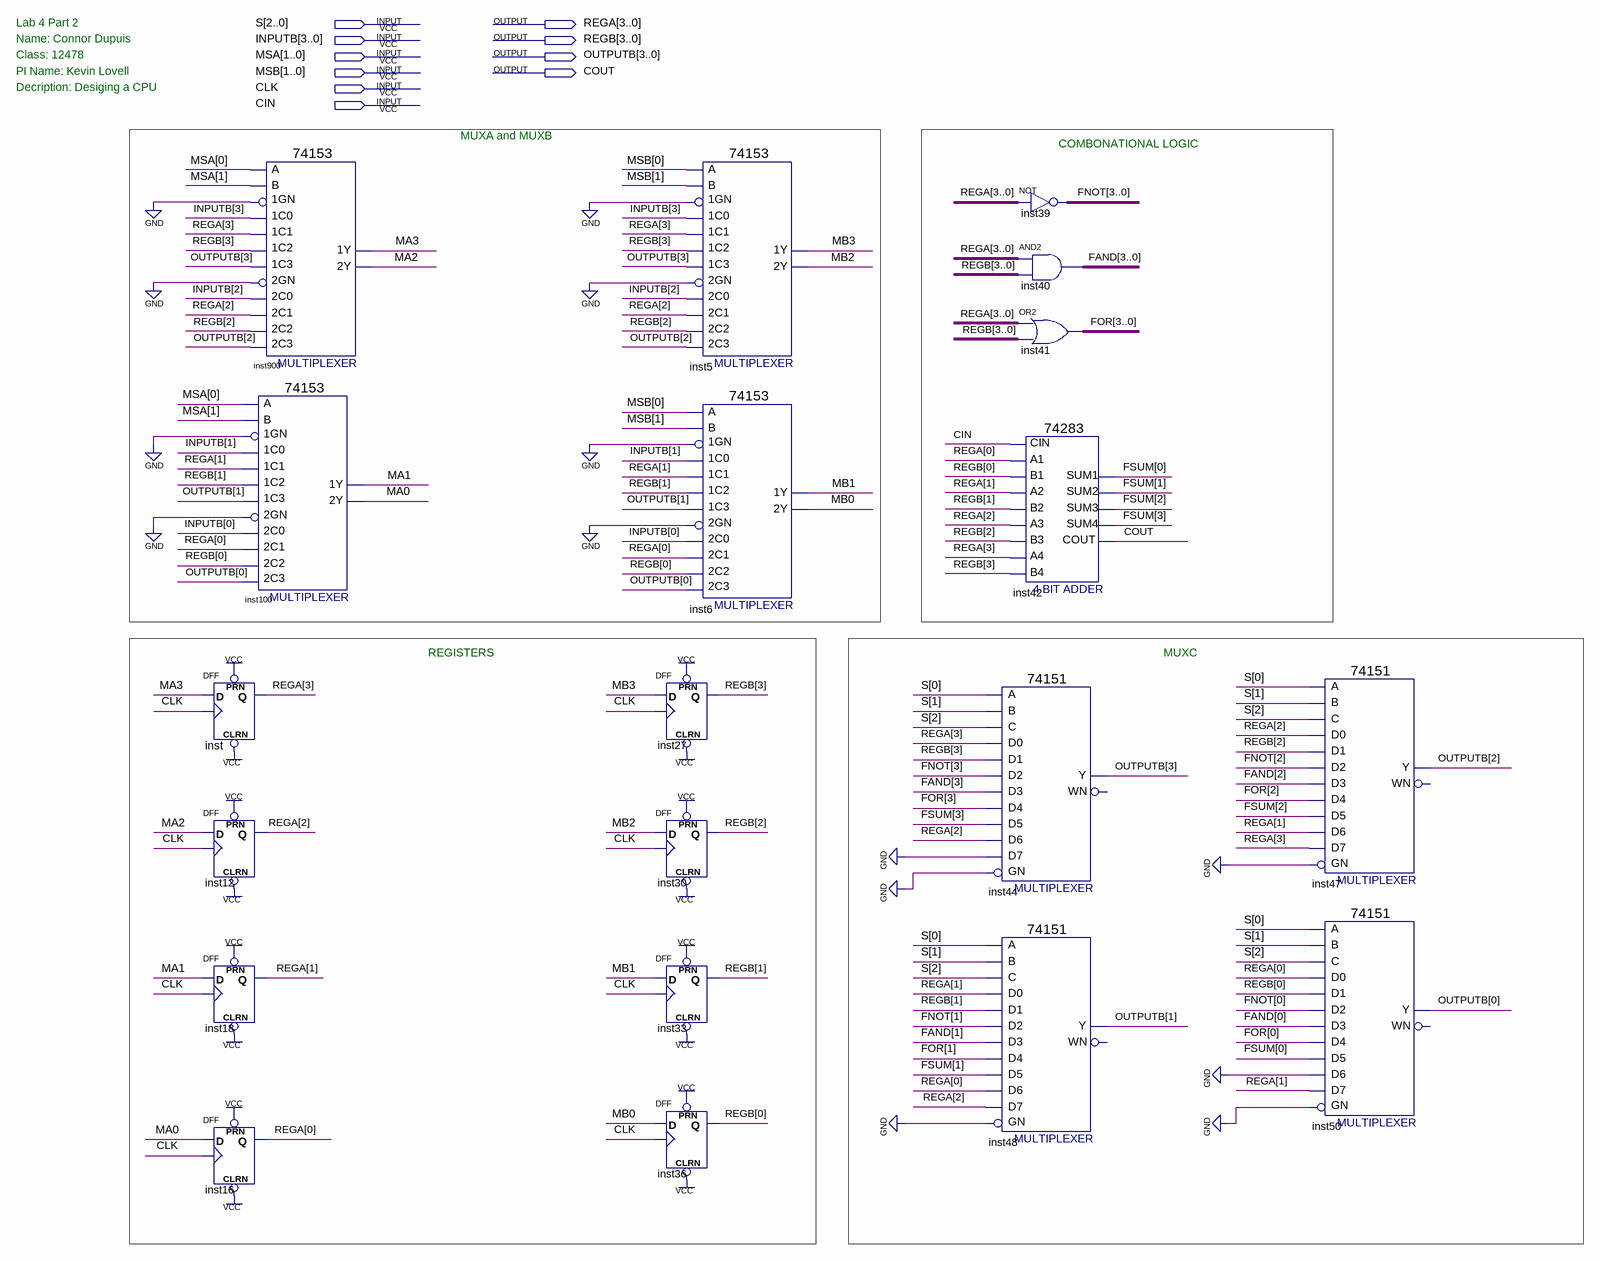
[diagram p0: schematic sheet]
// Quartus schematic Lab4_CPU.bdf as structural Verilog: 20 symbols, 10 pins
module Lab4_CPU (
  input  [2:0] S,
  input  [3:0] INPUTB,
  input  [1:0] MSA,
  input  [1:0] MSB,
  input  CLK,
  input  CIN,
  output [3:0] REGA,
  output [3:0] REGB,
  output [3:0] OUTPUTB,
  output COUT
);

  wire MA0, MA1, MA2, MA3, MB0, MB1, MB2, MB3;
  wire [3:0] FAND, FNOT, FOR, FSUM;

  DFF inst (.CLRN(1'b1), .CLK(CLK), .D(MA3), .PRN(1'b1), .Q(REGA[3]));
  DFF inst12 (.CLRN(1'b1), .CLK(CLK), .D(MA2), .PRN(1'b1), .Q(REGA[2]));
  DFF inst18 (.CLRN(1'b1), .CLK(CLK), .D(MA1), .PRN(1'b1), .Q(REGA[1]));
  DFF inst16 (.CLRN(1'b1), .CLK(CLK), .D(MA0), .PRN(1'b1), .Q(REGA[0]));
  \74153  inst900 (
    .\1C1 (REGA[3]), .\1GN (1'b0), .\1C0 (INPUTB[3]), .\2C0 (INPUTB[2]), .\2GN (1'b0), .\2C2 (REGB[2]),
    .\1C2 (REGB[3]), .\1C3 (OUTPUTB[3]), .B(MSA[1]), .A(MSA[0]), .\2C1 (REGA[2]), .\2C3 (OUTPUTB[2]),
    .\1Y (MA3), .\2Y (MA2));
  \74153  inst100 (
    .\1C1 (REGA[1]), .\1GN (1'b0), .\1C0 (INPUTB[1]), .\2C0 (INPUTB[0]), .\2GN (1'b0), .\2C2 (REGB[0]),
    .\1C2 (REGB[1]), .\1C3 (OUTPUTB[1]), .B(MSA[1]), .A(MSA[0]), .\2C1 (REGA[0]), .\2C3 (OUTPUTB[0]),
    .\1Y (MA1), .\2Y (MA0));
  DFF inst27 (.CLRN(1'b1), .CLK(CLK), .D(MB3), .PRN(1'b1), .Q(REGB[3]));
  DFF inst30 (.CLRN(1'b1), .CLK(CLK), .D(MB2), .PRN(1'b1), .Q(REGB[2]));
  DFF inst33 (.CLRN(1'b1), .CLK(CLK), .D(MB1), .PRN(1'b1), .Q(REGB[1]));
  DFF inst36 (.CLRN(1'b1), .CLK(CLK), .D(MB0), .PRN(1'b1), .Q(REGB[0]));
  \74153  inst5 (
    .\1C1 (REGA[3]), .\1GN (1'b0), .\1C0 (INPUTB[3]), .\2C0 (INPUTB[2]), .\2GN (1'b0), .\2C2 (REGB[2]),
    .\1C2 (REGB[3]), .\1C3 (OUTPUTB[3]), .B(MSB[1]), .A(MSB[0]), .\2C1 (REGA[2]), .\2C3 (OUTPUTB[2]),
    .\1Y (MB3), .\2Y (MB2));
  \74153  inst6 (
    .\1C1 (REGA[1]), .\1GN (1'b0), .\1C0 (INPUTB[1]), .\2C0 (INPUTB[0]), .\2GN (1'b0), .\2C2 (REGB[0]),
    .\1C2 (REGB[1]), .\1C3 (OUTPUTB[1]), .B(MSB[1]), .A(MSB[0]), .\2C1 (REGA[0]), .\2C3 (OUTPUTB[0]),
    .\1Y (MB1), .\2Y (MB0));
  assign FNOT = ~REGA;  // NOT inst39, 4 bits wide
  assign FAND = REGA & REGB;  // AND2 inst40, 4 bits wide
  assign FOR = REGA | REGB;  // OR2 inst41, 4 bits wide
  \74283  inst42 (
    .CIN(CIN), .A1(REGA[0]), .A2(REGA[1]), .B2(REGB[1]), .A3(REGA[2]), .A4(REGA[3]), .B4(REGB[3]),
    .B1(REGB[0]), .B3(REGB[2]), .SUM4(FSUM[3]), .COUT(COUT), .SUM1(FSUM[0]), .SUM2(FSUM[1]), .SUM3(FSUM[2]));
  \74151  inst44 (
    .GN(1'b0), .C(S[2]), .B(S[1]), .A(S[0]), .D5(FSUM[3]), .D0(REGA[3]), .D1(REGB[3]), .D4(FOR[3]),
    .D3(FAND[3]), .D2(FNOT[3]), .D6(REGA[2]), .D7(1'b0), .Y(OUTPUTB[3]));  // open: WN
  \74151  inst48 (
    .GN(1'b0), .C(S[2]), .B(S[1]), .A(S[0]), .D5(FSUM[1]), .D0(REGA[1]), .D1(REGB[1]), .D4(FOR[1]),
    .D3(FAND[1]), .D2(FNOT[1]), .D6(REGA[0]), .D7(REGA[2]), .Y(OUTPUTB[1]));  // open: WN
  \74151  inst47 (
    .GN(1'b0), .C(S[2]), .B(S[1]), .A(S[0]), .D5(FSUM[2]), .D0(REGA[2]), .D1(REGB[2]), .D4(FOR[2]),
    .D3(FAND[2]), .D2(FNOT[2]), .D6(REGA[1]), .D7(REGA[3]), .Y(OUTPUTB[2]));  // open: WN
  \74151  inst50 (
    .GN(1'b0), .C(S[2]), .B(S[1]), .A(S[0]), .D5(FSUM[0]), .D0(REGA[0]), .D1(REGB[0]), .D4(FOR[0]),
    .D3(FAND[0]), .D2(FNOT[0]), .D6(1'b0), .D7(REGA[1]), .Y(OUTPUTB[0]));  // open: WN

  // Notes on the sheet:
  //   Lab 4 Part 2
  //   Name: Connor Dupuis
  //   Class: 12478
  //   PI Name: Kevin Lovell
  //   Decription: Desiging a CPU
  //   MUXA and MUXB
  //   COMBONATIONAL LOGIC
  //   REGISTERS
  //   MUXC
endmodule
